# Altium schematic sheet PCIE_USB.SchDoc: PCIE_USB
size A3; Author: Silvio Navaretti; CompanyName: ARDUINO; DrawnBy: Silvio Navaretti; Engineer: Silvio Navaretti; Organization: ARDUINO; SheetNumber: 26; SheetTotal: 51; RevAuthor: Silvio Navaretti
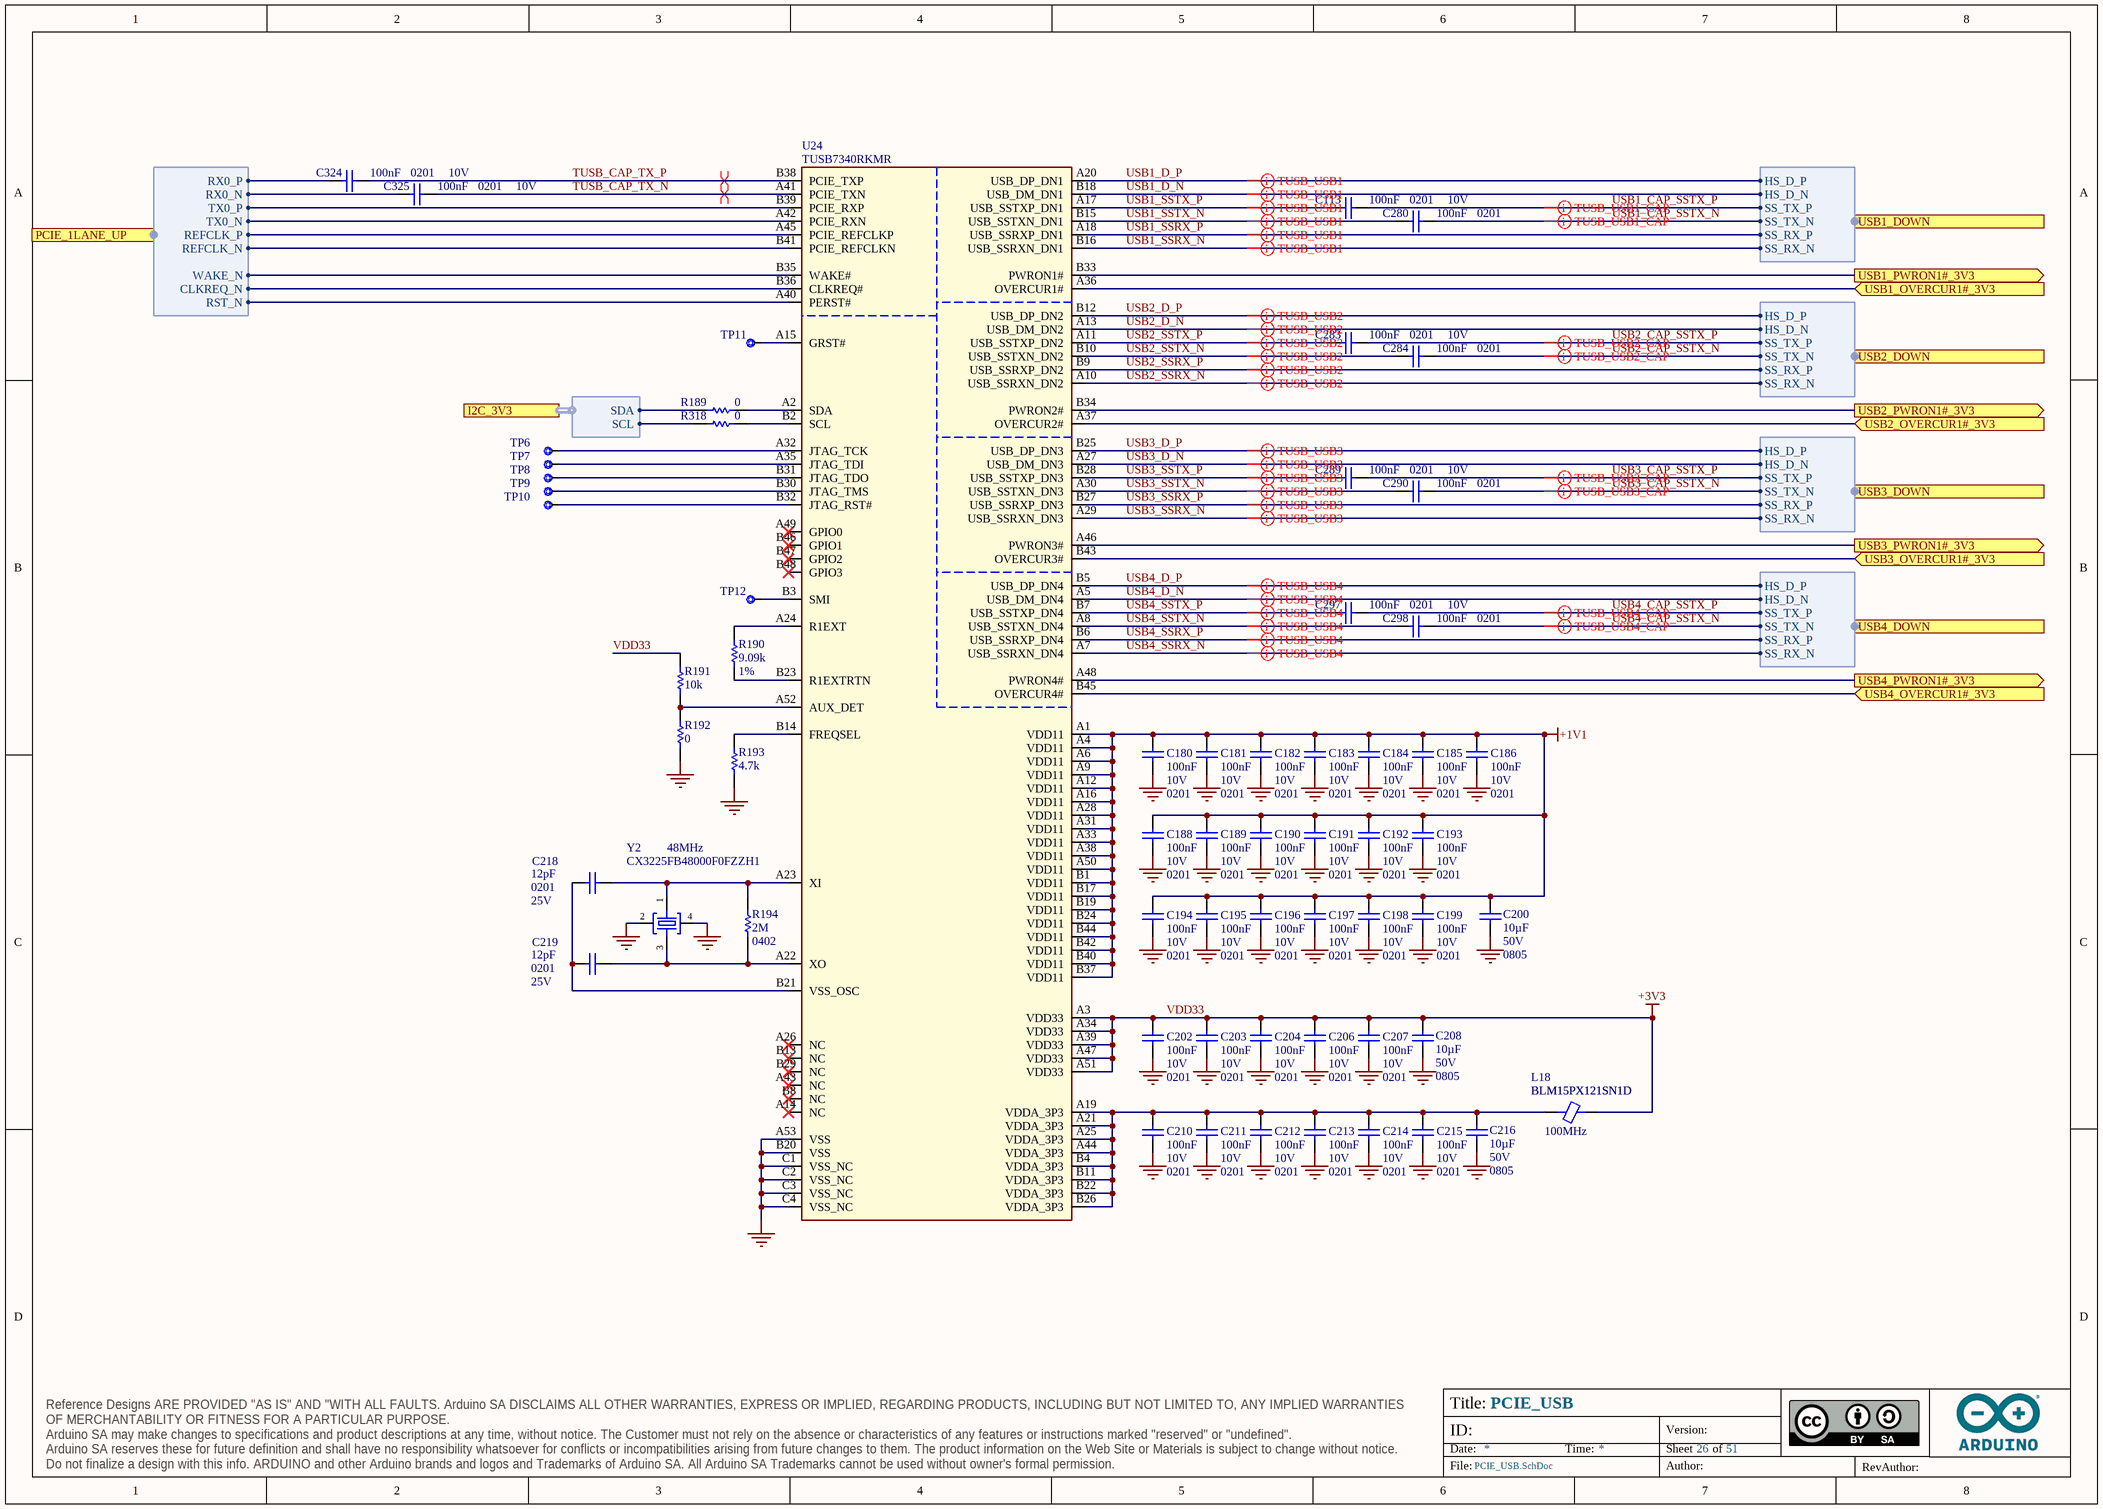
[diagram p0: PCIE_USB.SchDoc]

## Parts
C113  value 100nF  Case Code (Imperial): 0201  Voltage: 10V  [CAP-0201]  (hidden comment: CL03A104KP3NNNC)
C180  value 100nF  Voltage: 10V  Case Code (Imperial): 0201  [CAP-0201]  (hidden comment: CL03A104KP3NNNC)
C181  value 100nF  Voltage: 10V  Case Code (Imperial): 0201  [CAP-0201]  (hidden comment: CL03A104KP3NNNC)
C182  value 100nF  Voltage: 10V  Case Code (Imperial): 0201  [CAP-0201]  (hidden comment: CL03A104KP3NNNC)
C183  value 100nF  Voltage: 10V  Case Code (Imperial): 0201  [CAP-0201]  (hidden comment: CL03A104KP3NNNC)
C184  value 100nF  Voltage: 10V  Case Code (Imperial): 0201  [CAP-0201]  (hidden comment: CL03A104KP3NNNC)
C185  value 100nF  Voltage: 10V  Case Code (Imperial): 0201  [CAP-0201]  (hidden comment: CL03A104KP3NNNC)
C186  value 100nF  Voltage: 10V  Case Code (Imperial): 0201  [CAP-0201]  (hidden comment: CL03A104KP3NNNC)
C188  value 100nF  Voltage: 10V  Case Code (Imperial): 0201  [CAP-0201]  (hidden comment: CL03A104KP3NNNC)
C189  value 100nF  Voltage: 10V  Case Code (Imperial): 0201  [CAP-0201]  (hidden comment: CL03A104KP3NNNC)
C190  value 100nF  Voltage: 10V  Case Code (Imperial): 0201  [CAP-0201]  (hidden comment: CL03A104KP3NNNC)
C191  value 100nF  Voltage: 10V  Case Code (Imperial): 0201  [CAP-0201]  (hidden comment: CL03A104KP3NNNC)
C192  value 100nF  Voltage: 10V  Case Code (Imperial): 0201  [CAP-0201]  (hidden comment: CL03A104KP3NNNC)
C193  value 100nF  Voltage: 10V  Case Code (Imperial): 0201  [CAP-0201]  (hidden comment: CL03A104KP3NNNC)
C194  value 100nF  Voltage: 10V  Case Code (Imperial): 0201  [CAP-0201]  (hidden comment: CL03A104KP3NNNC)
C195  value 100nF  Voltage: 10V  Case Code (Imperial): 0201  [CAP-0201]  (hidden comment: CL03A104KP3NNNC)
C196  value 100nF  Voltage: 10V  Case Code (Imperial): 0201  [CAP-0201]  (hidden comment: CL03A104KP3NNNC)
C197  value 100nF  Voltage: 10V  Case Code (Imperial): 0201  [CAP-0201]  (hidden comment: CL03A104KP3NNNC)
C198  value 100nF  Voltage: 10V  Case Code (Imperial): 0201  [CAP-0201]  (hidden comment: CL03A104KP3NNNC)
C199  value 100nF  Voltage: 10V  Case Code (Imperial): 0201  [CAP-0201]  (hidden comment: CL03A104KP3NNNC)
C200  value 10µF  Voltage: 50V  Case Code (Imperial): 0805  [CAP-0805]  (hidden comment: GRM21BR61H106ME43L)
C202  value 100nF  Voltage: 10V  Case Code (Imperial): 0201  [CAP-0201]  (hidden comment: CL03A104KP3NNNC)
C203  value 100nF  Voltage: 10V  Case Code (Imperial): 0201  [CAP-0201]  (hidden comment: CL03A104KP3NNNC)
C204  value 100nF  Voltage: 10V  Case Code (Imperial): 0201  [CAP-0201]  (hidden comment: CL03A104KP3NNNC)
C206  value 100nF  Voltage: 10V  Case Code (Imperial): 0201  [CAP-0201]  (hidden comment: CL03A104KP3NNNC)
C207  value 100nF  Voltage: 10V  Case Code (Imperial): 0201  [CAP-0201]  (hidden comment: CL03A104KP3NNNC)
C208  value 10µF  Voltage: 50V  Case Code (Imperial): 0805  [CAP-0805]  (hidden comment: GRM21BR61H106ME43L)
C210  value 100nF  Voltage: 10V  Case Code (Imperial): 0201  [CAP-0201]  (hidden comment: CL03A104KP3NNNC)
C211  value 100nF  Voltage: 10V  Case Code (Imperial): 0201  [CAP-0201]  (hidden comment: CL03A104KP3NNNC)
C212  value 100nF  Voltage: 10V  Case Code (Imperial): 0201  [CAP-0201]  (hidden comment: CL03A104KP3NNNC)
C213  value 100nF  Voltage: 10V  Case Code (Imperial): 0201  [CAP-0201]  (hidden comment: CL03A104KP3NNNC)
C214  value 100nF  Voltage: 10V  Case Code (Imperial): 0201  [CAP-0201]  (hidden comment: CL03A104KP3NNNC)
C215  value 100nF  Voltage: 10V  Case Code (Imperial): 0201  [CAP-0201]  (hidden comment: CL03A104KP3NNNC)
C216  value 10µF  Voltage: 50V  Case Code (Imperial): 0805  [CAP-0805]  (hidden comment: GRM21BR61H106ME43L)
C218  value 12pF  Case Code (Imperial): 0201  Voltage: 25V  [CAP-0201]  (hidden comment: GRM0335C1E120JA01J)
C219  value 12pF  Case Code (Imperial): 0201  Voltage: 25V  [CAP-0201]  (hidden comment: GRM0335C1E120JA01J)
C280  value 100nF  Case Code (Imperial): 0201  [CAP-0201]  (hidden comment: CL03A104KP3NNNC)
C283  value 100nF  Case Code (Imperial): 0201  Voltage: 10V  [CAP-0201]  (hidden comment: CL03A104KP3NNNC)
C284  value 100nF  Case Code (Imperial): 0201  [CAP-0201]  (hidden comment: CL03A104KP3NNNC)
C289  value 100nF  Case Code (Imperial): 0201  Voltage: 10V  [CAP-0201]  (hidden comment: CL03A104KP3NNNC)
C290  value 100nF  Case Code (Imperial): 0201  [CAP-0201]  (hidden comment: CL03A104KP3NNNC)
C297  value 100nF  Case Code (Imperial): 0201  Voltage: 10V  [CAP-0201]  (hidden comment: CL03A104KP3NNNC)
C298  value 100nF  Case Code (Imperial): 0201  [CAP-0201]  (hidden comment: CL03A104KP3NNNC)
C324  value 100nF  Case Code (Imperial): 0201  Voltage: 10V  [CAP-0201]  (hidden comment: CL03A104KP3NNNC)
C325  value 100nF  Case Code (Imperial): 0201  Voltage: 10V  [CAP-0201]  (hidden comment: CL03A104KP3NNNC)
L18  BLM15PX121SN1D  Test Frequency: 100MHz  [L-0402]
R189  value 0  [RES-0201]  (hidden comment: CRCW02010000Z0ED)
R190  value 9.09k  Tolerance: 1%  [RES-0201]  (hidden comment: RC0201FR-079K09L)
R191  value 10k  [RES-0201]  (hidden comment: RC0201FR-0710KL)
R192  value 0  [RES-0201]  (hidden comment: CRCW02010000Z0ED)
R193  value 4.7k  [RES-0201]  (hidden comment: RC0201FR-074K7L)
R194  value 2M  Case Code (Imperial): 0402  [RES-0402]  (hidden comment: RC0402FR-072ML)
R318  value 0  [RES-0201]  (hidden comment: CRCW02010000Z0ED)
TP6  Test point 1.00mm  [TP-1.00MM]  (value not drawn)  (no BOM)
TP7  Test point 1.00mm  [TP-1.00MM]  (value not drawn)  (no BOM)
TP8  Test point 1.00mm  [TP-1.00MM]  (value not drawn)  (no BOM)
TP9  Test point 1.00mm  [TP-1.00MM]  (value not drawn)  (no BOM)
TP10  Test point 1.00mm  [TP-1.00MM]  (value not drawn)  (no BOM)
TP11  Test point 1.00mm  [TP-1.00MM]  (value not drawn)  (no BOM)
TP12  Test point 1.00mm  [TP-1.00MM]  (value not drawn)  (no BOM)
U24  TUSB7340RKMR  [TI RKM S-PWQFN-N100 Double row 9x9mm pitch 0.6mm]
Y2  CX3225FB48000F0FZZH1  Frequency: 48MHz  [CRYSTAL3.2X2.5]

## Ports
I2C_3V3 (harness I2C), PCIE_1LANE_UP (harness PCIE_1LANE), USB1_DOWN (harness SOM_MD_USB0), USB1_OVERCUR1#_3V3 (in), USB1_PWRON1#_3V3 (out), USB2_DOWN (harness SOM_MD_USB0), USB2_OVERCUR1#_3V3 (in), USB2_PWRON1#_3V3 (out), USB3_DOWN (harness SOM_MD_USB0), USB3_OVERCUR1#_3V3 (in), USB3_PWRON1#_3V3 (out), USB4_DOWN (harness SOM_MD_USB0), USB4_OVERCUR1#_3V3 (in), USB4_PWRON1#_3V3 (out)

## Harnesses
SOM_MD_USB0: SS_TX_N, SS_TX_P, HS_D_P, HS_D_N, SS_RX_P, SS_RX_N
PCIE_1LANE: RX0_N, RX0_P, TX0_P, TX0_N, REFCLK_N, REFCLK_P, WAKE_N, CLKREQ_N, RST_N
I2C: SDA, SCL

## Nets
+1V1: C180.2 C181.2 C182.2 C183.2 C184.2 C185.2 C186.2 C188.2 C189.2 C190.2 C191.2 C192.2 C193.2 C194.2 C195.2 C196.2 C197.2 C198.2 C199.2 C200.2 U24.A1(VDD11) U24.A4(VDD11) U24.A6(VDD11) U24.A9(VDD11) U24.A12(VDD11) U24.A16(VDD11) U24.A28(VDD11) U24.A31(VDD11) U24.A33(VDD11) U24.A38(VDD11) U24.A50(VDD11) U24.B1(VDD11) U24.B17(VDD11) U24.B19(VDD11) U24.B24(VDD11) U24.B37(VDD11) U24.B40(VDD11) U24.B42(VDD11) U24.B44(VDD11)
GND: C180.1 C181.1 C182.1 C183.1 C184.1 C185.1 C186.1 C188.1 C189.1 C190.1 C191.1 C192.1 C193.1 C194.1 C195.1 C196.1 C197.1 C198.1 C199.1 C200.1 C202.1 C203.1 C204.1 C206.1 C207.1 C208.1 C210.1 C211.1 C212.1 C213.1 C214.1 C215.1 C216.1 R192.2 R193.2 U24.A53(VSS) U24.B20(VSS) U24.C1(VSS_NC) U24.C2(VSS_NC) U24.C3(VSS_NC) U24.C4(VSS_NC) Y2.2 Y2.4
VDD33: C202.2 C203.2 C204.2 C206.2 C207.2 C208.2 L18.2 R191.2 U24.A3(VDD33) U24.A34(VDD33) U24.A39(VDD33) U24.A47(VDD33) U24.A51(VDD33)  [also labelled +3V3]
TUSB_CAP_TX_N: C325.2 U24.A41(PCIE_TXN)
TUSB_CAP_TX_P: C324.2 U24.B38(PCIE_TXP)
USB1_CAP_SSTX_N: C280.2 ; port USB1_DOWN.SS_TX_N
USB1_CAP_SSTX_P: C113.2 ; port USB1_DOWN.SS_TX_P
USB1_D_N: U24.B18(USB_DM_DN1) ; port USB1_DOWN.HS_D_N
USB1_D_P: U24.A20(USB_DP_DN1) ; port USB1_DOWN.HS_D_P
USB1_OVERCUR1#_3V3: U24.A36(OVERCUR1#) ; port USB1_OVERCUR1#_3V3
USB1_PWRON1#_3V3: U24.B33(PWRON1#) ; port USB1_PWRON1#_3V3
USB1_SSRX_N: U24.B16(USB_SSRXN_DN1) ; port USB1_DOWN.SS_RX_N
USB1_SSRX_P: U24.A18(USB_SSRXP_DN1) ; port USB1_DOWN.SS_RX_P
USB1_SSTX_N: C280.1 U24.B15(USB_SSTXN_DN1)
USB1_SSTX_P: C113.1 U24.A17(USB_SSTXP_DN1)
USB2_CAP_SSTX_N: C284.2 ; port USB2_DOWN.SS_TX_N
USB2_CAP_SSTX_P: C283.2 ; port USB2_DOWN.SS_TX_P
USB2_D_N: U24.A13(USB_DM_DN2) ; port USB2_DOWN.HS_D_N
USB2_D_P: U24.B12(USB_DP_DN2) ; port USB2_DOWN.HS_D_P
USB2_OVERCUR1#_3V3: U24.A37(OVERCUR2#) ; port USB2_OVERCUR1#_3V3
USB2_PWRON1#_3V3: U24.B34(PWRON2#) ; port USB2_PWRON1#_3V3
USB2_SSRX_N: U24.A10(USB_SSRXN_DN2) ; port USB2_DOWN.SS_RX_N
USB2_SSRX_P: U24.B9(USB_SSRXP_DN2) ; port USB2_DOWN.SS_RX_P
USB2_SSTX_N: C284.1 U24.B10(USB_SSTXN_DN2)
USB2_SSTX_P: C283.1 U24.A11(USB_SSTXP_DN2)
USB3_CAP_SSTX_N: C290.2 ; port USB3_DOWN.SS_TX_N
USB3_CAP_SSTX_P: C289.2 ; port USB3_DOWN.SS_TX_P
USB3_D_N: U24.A27(USB_DM_DN3) ; port USB3_DOWN.HS_D_N
USB3_D_P: U24.B25(USB_DP_DN3) ; port USB3_DOWN.HS_D_P
USB3_OVERCUR1#_3V3: U24.B43(OVERCUR3#) ; port USB3_OVERCUR1#_3V3
USB3_PWRON1#_3V3: U24.A46(PWRON3#) ; port USB3_PWRON1#_3V3
USB3_SSRX_N: U24.A29(USB_SSRXN_DN3) ; port USB3_DOWN.SS_RX_N
USB3_SSRX_P: U24.B27(USB_SSRXP_DN3) ; port USB3_DOWN.SS_RX_P
USB3_SSTX_N: C290.1 U24.A30(USB_SSTXN_DN3)
USB3_SSTX_P: C289.1 U24.B28(USB_SSTXP_DN3)
USB4_CAP_SSTX_N: C298.2 ; port USB4_DOWN.SS_TX_N
USB4_CAP_SSTX_P: C297.2 ; port USB4_DOWN.SS_TX_P
USB4_D_N: U24.A5(USB_DM_DN4) ; port USB4_DOWN.HS_D_N
USB4_D_P: U24.B5(USB_DP_DN4) ; port USB4_DOWN.HS_D_P
USB4_OVERCUR1#_3V3: U24.B45(OVERCUR4#) ; port USB4_OVERCUR1#_3V3
USB4_PWRON1#_3V3: U24.A48(PWRON4#) ; port USB4_PWRON1#_3V3
USB4_SSRX_N: U24.A7(USB_SSRXN_DN4) ; port USB4_DOWN.SS_RX_N
USB4_SSRX_P: U24.B6(USB_SSRXP_DN4) ; port USB4_DOWN.SS_RX_P
USB4_SSTX_N: C298.1 U24.A8(USB_SSTXN_DN4)
USB4_SSTX_P: C297.1 U24.B7(USB_SSTXP_DN4)
NetC210_2: C210.2 C211.2 C212.2 C213.2 C214.2 C215.2 C216.2 L18.1 U24.A19(VDDA_3P3) U24.A21(VDDA_3P3) U24.A25(VDDA_3P3) U24.A44(VDDA_3P3) U24.B4(VDDA_3P3) U24.B11(VDDA_3P3) U24.B22(VDDA_3P3) U24.B26(VDDA_3P3)
NetC218_1: C218.1 R194.2 U24.A23(XI) Y2.1
NetC218_2: C218.2 C219.2 U24.B21(VSS_OSC)
NetC219_1: C219.1 R194.1 U24.A22(XO) Y2.3
NetC324_1: C324.1 ; port PCIE_1LANE_UP.RX0_P
NetC325_1: C325.1 ; port PCIE_1LANE_UP.RX0_N
NetR189_1: R189.1 ; port I2C_3V3.SDA
NetR189_2: R189.2 U24.A2(SDA)
NetR190_1: R190.1 U24.A24(R1EXT)
NetR190_2: R190.2 U24.B23(R1EXTRTN)
NetR191_1: R191.1 R192.1 U24.A52(AUX_DET)
NetR193_1: R193.1 U24.B14(FREQSEL)
NetR318_1: R318.1 ; port I2C_3V3.SCL
NetR318_2: R318.2 U24.B2(SCL)
NetTP6_X: TP6.X U24.A32(JTAG_TCK)
NetTP7_X: TP7.X U24.A35(JTAG_TDI)
NetTP8_X: TP8.X U24.B31(JTAG_TDO)
NetTP9_X: TP9.X U24.B30(JTAG_TMS)
NetTP10_X: TP10.X U24.B32(JTAG_RST#)
NetTP11_X: TP11.X U24.A15(GRST#)
NetTP12_X: TP12.X U24.B3(SMI)
NetU24_A40: U24.A40(PERST#) ; port PCIE_1LANE_UP.RST_N
NetU24_A42: U24.A42(PCIE_RXN) ; port PCIE_1LANE_UP.TX0_N
NetU24_A45: U24.A45(PCIE_REFCLKP) ; port PCIE_1LANE_UP.REFCLK_P
NetU24_B35: U24.B35(WAKE#) ; port PCIE_1LANE_UP.WAKE_N
NetU24_B36: U24.B36(CLKREQ#) ; port PCIE_1LANE_UP.CLKREQ_N
NetU24_B39: U24.B39(PCIE_RXP) ; port PCIE_1LANE_UP.TX0_P
NetU24_B41: U24.B41(PCIE_REFCLKN) ; port PCIE_1LANE_UP.REFCLK_N

Not connected (* = marked no-connect by the designer): U24 A14(NC)* A26(NC)* A43(NC)* A49(GPIO0)* B8(NC)* B13(NC)* B29(NC)* B46(GPIO1)* B47(GPIO2)* B48(GPIO3)*

## Layout directives
differential pair; differential pair class PCIE_USB_CAPS: TUSB_CAP_TX_N, TUSB_CAP_TX_P
differential pair; differential pair class TUSB_USB1: USB1_D_N, USB1_D_P, USB1_SSRX_N, USB1_SSRX_P, USB1_SSTX_N, USB1_SSTX_P
differential pair; differential pair class TUSB_USB2: USB2_D_N, USB2_D_P, USB2_SSRX_N, USB2_SSRX_P, USB2_SSTX_N, USB2_SSTX_P
differential pair; differential pair class TUSB_USB3: USB3_D_N, USB3_D_P, USB3_SSRX_N, USB3_SSRX_P, USB3_SSTX_N, USB3_SSTX_P
differential pair; differential pair class TUSB_USB4: USB4_D_N, USB4_D_P, USB4_SSRX_N, USB4_SSRX_P, USB4_SSTX_N, USB4_SSTX_P
differential pair; differential pair class TUSB_USB1_CAP: USB1_CAP_SSTX_N, USB1_CAP_SSTX_P
differential pair; differential pair class TUSB_USB2_CAP: USB2_CAP_SSTX_N, USB2_CAP_SSTX_P
differential pair; differential pair class TUSB_USB3_CAP: USB3_CAP_SSTX_N, USB3_CAP_SSTX_P
differential pair; differential pair class TUSB_USB4_CAP: USB4_CAP_SSTX_N, USB4_CAP_SSTX_P

## Notes on the sheet
- Title:
- ID:
- Date:
- Time:
- Version:
- Sheet
- of
- RevAuthor:
- Reference Designs ARE PROVIDED "AS IS" AND "WITH ALL FAULTS. Arduino SA DISCLAIMS ALL OTHER WARRANTIES, EXPRESS OR IMPLIED, REGARDING PRODUCTS, INCLUDING BUT NOT LIMITED TO, ANY IMPLIED WARRANTIES OF MERCHANTABILITY OR FITNESS FOR A PARTICULAR PURPOSE.
  Arduino SA may make changes to specifications and product descriptions at any time, without notice. The Customer must not rely on the absence or characteristics of any features or instructions marked "reserved" or "undefined".
  Arduino SA reserves these for future definition and shall have no responsibility whatsoever for conflicts or incompatibilities arising from future changes to them. The product information on the Web Site or Materials is subject to change without notice.
  Do not finalize a design with this info. ARDUINO and other Arduino brands and logos and Trademarks of Arduino SA. All Arduino SA Trademarks cannot be used without owner's formal permission.
- File:
- Author:

## Library data of the parts
C113 C180-C186 C188-C199 C202-C204 C206 C207 C210-C215 C280 C283 C284 C289 C290 C297 C298 C324 C325 = C0113-A.6: CAP CHIP 0201 100nF 10% 10V X5R; Manufacturer: Samsung Electro-Mechanics; Code Arduino: C0113; Technology: Ceramic; Tolerance: 10%; Part Number: CL03A104KP3NNNC; Dielectric: X5R
C200 C208 C216 = C0158-A.3: CAP CHIP 0805 10uF 20% 50V X5R; Manufacturer: Murata Electronics; Code Arduino: C0158; Dielectric: X5R; Technology: SMD; Part Number: GRM21BR61H106ME43L; Tolerance: 20%
C218 C219 = C0003-A.15: CAP CHIP 0201 12pF 5% 25V C0G; Manufacturer: Murata; Code Arduino: C0003; Technology: Ceramic; Part Number: GRM0335C1E120JA01J; Tolerance: 5%; Dielectric: C0G
L18 = I0028-A.10: FERRITE SMD 0402 120Ohm 25% 100MHz Ferrite 2A; Manufacturer: Murata; Inductance: 120µH; DC Resistance (DCR): 55mR; Code Arduino: I0028; Value: 120µH; Part Number: BLM15PX121SN1D; Device Type: Ferrite; Packaging: Tape and Reel; Case Code (Imperial): 0402; Max DC Current: 2A; Case Code (Metric): 1005; Package Quantity: 10000; Current: 2A; Max Operating Temperature: 125°C; Tolerance: 25%; Min Operating Temperature: -55°C
R189 R192 R318 = R0140-A.21: RES CHIP 0201 0R; Manufacturer: Vishay; Temperature coefficient: 0ppm; Code Arduino: R0140; Power: 50mW; Tolerance: 0%; Technology: Thick film; Case Code (Imperial): 0201; Part Number: CRCW02010000Z0ED
R190 = R0397-A.2: RES CHIP 0201 9k09 1% 1/20W; Manufacturer: YAGEO; Code Arduino: R0397; Power: 50mW; Temperature Coefficient: 200ppm; Technology: Thick film; Part Number: RC0201FR-079K09L; Case Code (Imperial): 0201
R191 = R0145-A.21: RES CHIP 0201 10k 1% 1/20W; Manufacturer: Yageo; Power: 50mW; Temperature coefficient: 200ppm; Code Arduino: R0145; Manufacturer 2: Samsung Electro-Mechanics; Tolerance: 1%; Case Code (Imperial): 0201; Part Number: RC0201FR-0710KL; Technology: Thick film
R193 = R0151-A.21: RES CHIP 0201 4k7 1% 1/20W; Manufacturer: Yageo; Temperature coefficient: 200ppm; Power: 50mW; Code Arduino: A5521; Technology: Thick film; Case Code (Imperial): 0201; Part Number: RC0201FR-074K7L; Tolerance: 1%
R194 = R0394-A.1: RES CHIP 0402 2M 1% 1/16W; Manufacturer: YAGEO; Temperature coefficient: 100ppm; Code Arduino: R0394; Power: 62.5mW; Technology: Thick film; Part Number: RC0402FR-072ML; Tolerance: 1%
TP6-TP12 = UT0013-A.6: Part Number: This is not a component; Design Item ID: CMP-018-0005-A.3; Source: ut.SchLib; Manufacturer: This is not a component; Code Arduino: This is not a component; Pin Count: 1
U24 = U0510-A.10: IC PCIe x1 Gen2 to x4 USB 3.0 converter, QFN-MR100 9x9mm; Manufacturer: Texas Instruments; Code Arduino: U0510; Part Number: TUSB7340RKMR
Y2 = X0032-A.3: CRYSTAL 48MHz tolerance 10ppm stability 20ppm load 10pF 3.2x2.5mm; Manufacturer: Kyocera; Series Resistance: 30R; ESR (Equivalent Series Resistance): 30; Code Arduino: X0032; Max Operating Temperature: 85°C; Frequency Tolerance: 10ppm; Load Capacitance: 10pF; Min Operating Temperature: -40°C; Frequency Stability: 20ppm; Part Number: CX3225FB48000F0FZZH1